# EasyEDA Pro project ProPrj_stc8h1k_ESC_2025-05-31.epro

# Schematic STC8H1K_1
Board Name: STC8H1K电调_1; Create Date: 2025-03-03; Page Name: STC8H1K; Project Name: stc8h1k电调; Schematic Name: STC8H1K_1; Update Date: 2025-05-28; Add into BOM: yes; Convert to PCB: yes
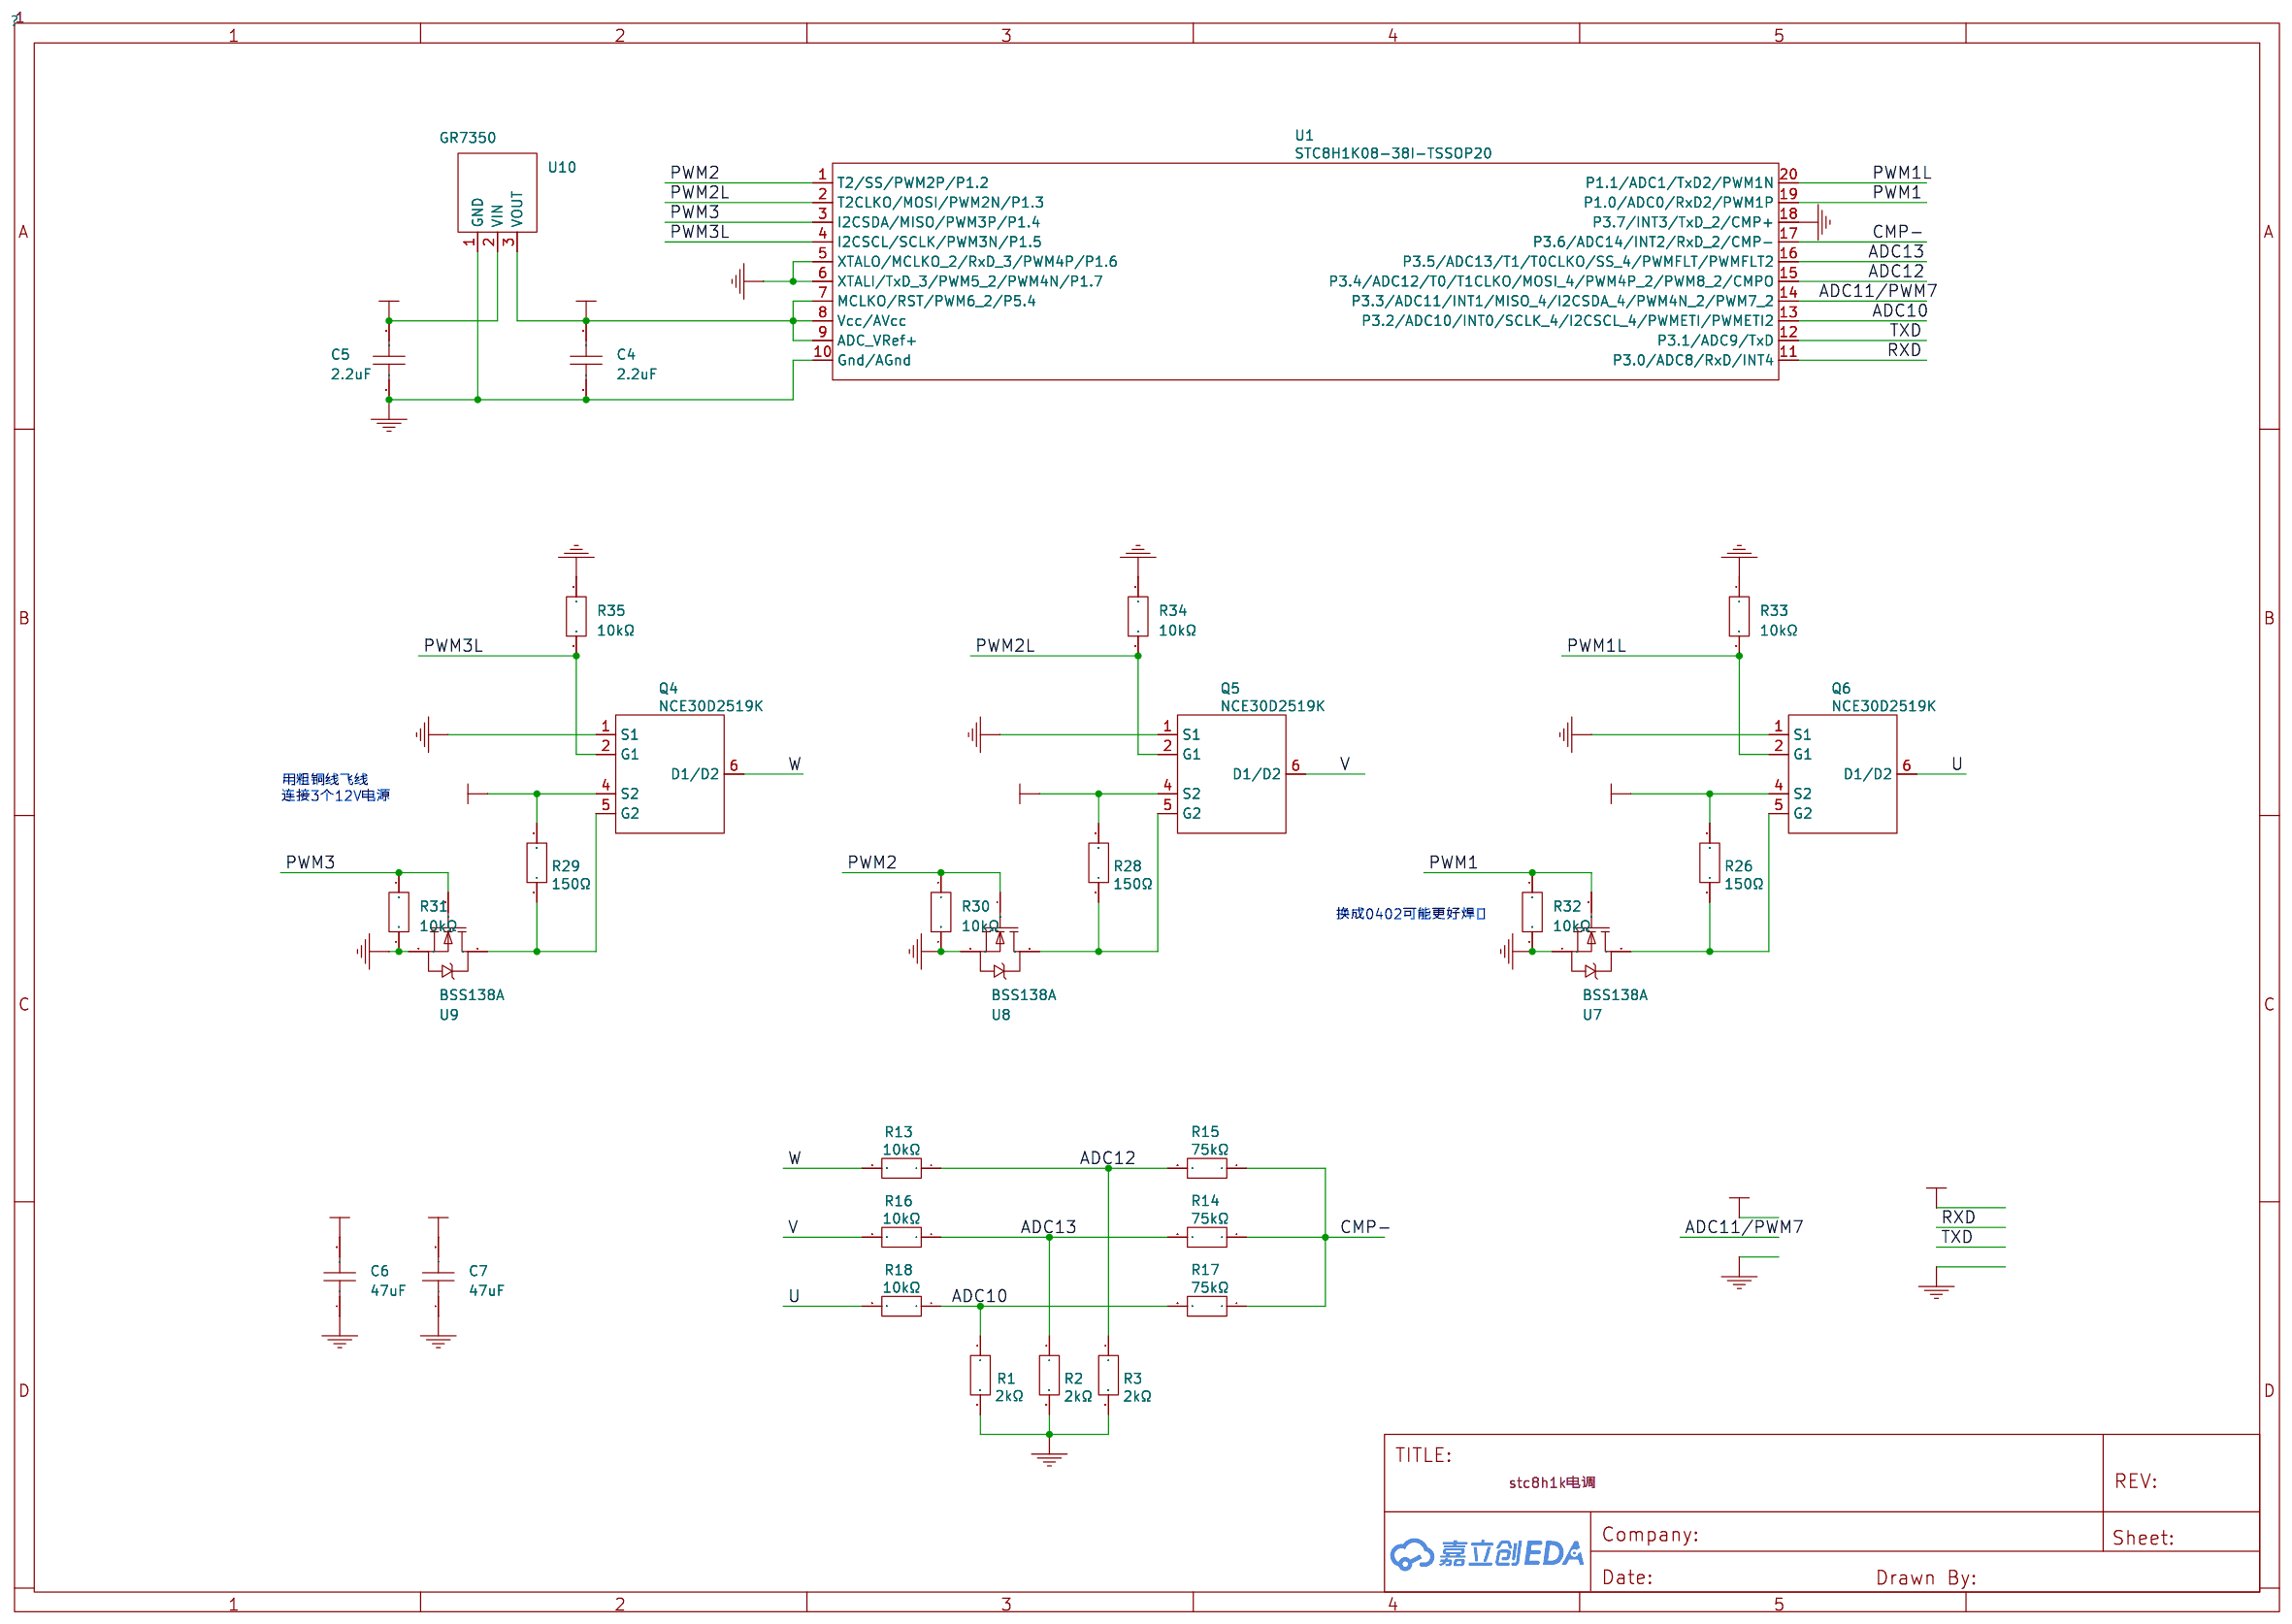
[diagram p0: schematic sheet]

## Parts
C4  2.2uF  [C0603]
C5  2.2uF  [C0603]
C6  47uF  [C1206]
C7  47uF  [C1206]
Q4  NCE30D2519K  [TO-252-5-11_L6.5-W6.2-P1.14-LS10.0-BR]
Q5  NCE30D2519K  [TO-252-5-11_L6.5-W6.2-P1.14-LS10.0-BR]
Q6  NCE30D2519K  [TO-252-5-11_L6.5-W6.2-P1.14-LS10.0-BR]
R1  2kΩ  [R0603]
R2  2kΩ  [R0603]
R3  2kΩ  [R0603]
R13  10kΩ  [R0603]
R14  75kΩ  [R0603]
R15  75kΩ  [R0603]
R16  10kΩ  [R0603]
R17  75kΩ  [R0603]
R18  10kΩ  [R0603]
R26  150Ω  [R0603]
R28  150Ω  [R0603]
R29  150Ω  [R0603]
R30  10kΩ  [R0603]
R31  10kΩ  [R0603]
R32  10kΩ  [R0603]
R33  10kΩ  [R0402]
R34  10kΩ  [R0402]
R35  10kΩ  [R0402]
U1  STC8H1K08-38I-TSSOP20  [TSSOP-20_L6.5-W4.4-P0.65-LS6.4-BL]
U7  BSS138A  [SOT-23-3_L2.9-W1.3-P0.95-LS2.4-BR]
U8  BSS138A  [SOT-23-3_L2.9-W1.3-P0.95-LS2.4-BR]
U9  BSS138A  [SOT-23-3_L2.9-W1.3-P0.95-LS2.4-BR]
U10  GR7350  [SOT-23-3_L2.9-W1.6-P1.90-LS2.8-BR-CW]

## Library data of the parts
C4 C5 = CL10A225KA8NNNC: 容值:2.2uF;精度:±10%;额定电压:25V;材质(温度系数):X5R;; LCSC Part Name: 2.2uF ±10% 25V; Supplier Part: C57895; Manufacturer: SAMSUNG(三星); Supplier Footprint: 0603; JLCPCB Part Class: Extended Part; Datasheet: https://atta.szlcsc.com/upload/public/pdf/source/20160218/1457707763339.pdf; Supplier: LCSC; Tolerance: ±10%; Voltage Rated: 25V; Temperature Coefficient: X5R
C6 C7 = GRM31CR61E476ME44L: 容值:47uF;精度:±20%;额定电压:25V;材质(温度系数):X5R;; LCSC Part Name: 47uF ±20% 25V; Supplier Part: C403725; Manufacturer: muRata(村田); Supplier Footprint: 1206; JLCPCB Part Class: 扩展库; Datasheet: https://atta.szlcsc.com/upload/public/pdf/source/20191025/C403725_B8A8CD2FFA1F57E6FDF268BD106459D5.pdf; Supplier: LCSC; Tolerance: ±20%; Voltage Rated: 25V; Temperature Coefficient: X5R
Q4-Q6 = NCE30D2519K: Supplier: LCSC; Supplier Part: C216790; Manufacturer: NCE(无锡新洁能); JLCPCB Part Class: Extended Part
R1-R3 = 0603WAF2001T5E: 电阻类型:厚膜电阻;阻值:2kΩ;精度:±1%;功率:100mW;最大工作电压:75V;温度系数:±100ppm/℃;; LCSC Part Name: 2kΩ ±1% 100mW 厚膜电阻; Supplier Part: C22975; Manufacturer: UNI-ROYAL(厚声); Supplier Footprint: 0603; JLCPCB Part Class: Basic Part; Datasheet: https://atta.szlcsc.com/upload/public/pdf/source/20200306/C422600_1E6D84923E4A46A82E41ADD87F860B5C.pdf; Supplier: LCSC; Type: 厚膜电阻; Tolerance: ±1%; Power(Watts): 100mW; Overload Voltage (Max): 75V; Temperature Coefficient: ±100ppm/℃; Operating Temperature Range: -55℃~+155℃
R13 R16 R18 R30-R35 = RT0603BRE075KL: 电阻类型:薄膜电阻;阻值:5kΩ;精度:±0.1%;功率:100mW;温度系数:±50ppm/℃;; LCSC Part Name: 薄膜电阻 5kΩ ±0.1% 100mW; Supplier Part: C862232; Manufacturer: YAGEO(国巨); Supplier Footprint: 0603; JLCPCB Part Class: Extended Part; Datasheet: https://atta.szlcsc.com/upload/public/pdf/source/20200610/C326738_5639A9F1B6EB6E4AE2197577D3456E7F.pdf; Supplier: LCSC; Type: 薄膜电阻; Tolerance: ±0.1%; Power(Watts): 100mW; Temperature Coefficient: ±50ppm/℃; Operating Temperature Range: -55℃~+155℃
R14 R15 R17 = 0603WAF1003T5E: 电阻类型:厚膜电阻;阻值:100kΩ;精度:±1%;功率:100mW;最大工作电压:75V;温度系数:±100ppm/℃;; LCSC Part Name: 100kΩ ±1% 100mW 厚膜电阻; Supplier Part: C25803; Manufacturer: UNI-ROYAL(厚声); Supplier Footprint: 0603; JLCPCB Part Class: Basic Part; Datasheet: https://atta.szlcsc.com/upload/public/pdf/source/20200306/C422600_1E6D84923E4A46A82E41ADD87F860B5C.pdf; Supplier: LCSC; Type: 厚膜电阻; Tolerance: ±1%; Power(Watts): 100mW; Overload Voltage (Max): 75V; Temperature Coefficient: ±100ppm/℃; Operating Temperature Range: -55℃~+155℃
R26 R28 R29 = 0603WAJ0151T5E: 电阻类型:厚膜电阻;阻值:150Ω;精度:±5%;功率:100mW;最大工作电压:75V;温度系数:±100ppm/℃;; LCSC Part Name: 150Ω ±5% 100mW 厚膜电阻; Supplier Part: C25208; Manufacturer: UNI-ROYAL(厚声); Supplier Footprint: 0603; JLCPCB Part Class: Extended Part; Datasheet: https://atta.szlcsc.com/upload/public/pdf/source/20200306/C422600_1E6D84923E4A46A82E41ADD87F860B5C.pdf; Supplier: LCSC; Type: 厚膜电阻; Tolerance: ±5%; Power(Watts): 100mW; Overload Voltage (Max): 75V; Temperature Coefficient: ±100ppm/℃; Operating Temperature Range: -55℃~+155℃
U1 = STC8H1K08-38I-TSSOP20: Supplier: LCSC; Supplier Part: C2928099; Manufacturer: null
U7-U9 = BSS138: 类型:N沟道;漏源电压(Vdss):50V;连续漏极电流(Id):220mA;功率(Pd):360mW;导通电阻(RDS(on)@Vgs,Id):3.5Ω@10V,220mA;阈值电压(Vgs(th)@Id):1.5V@1mA;; LCSC Part Name: N沟道 50V 220mA; Supplier Part: C52895; Manufacturer: onsemi(安森美); Supplier Footprint: SOT-23(SOT-23-3); JLCPCB Part Class: Extended Part; Datasheet: https://atta.szlcsc.com/upload/public/pdf/source/20170412/1491969107299.pdf; Supplier: LCSC; Type: N沟道; Drain Source Voltage (Vdss): 50V; Continuous Drain Current (Id): 220mA; Power Dissipation (Pd): 360mW; Drain Source On Resistance (RDS(on)@Vgs,Id): 3.5Ω@10V,220mA; Gate Threshold Voltage (Vgs(th)@Id): 1.5V@1mA
U10 = HG7550M3-1/TR: 输出类型:固定;工作电压:36V;输出电压:5V;输出电流:100mA;电源纹波抑制比(PSRR):-;输出极性:正极;; LCSC Part Name: CMOS 低压差线性稳压器; Supplier Part: C2926286; Manufacturer: HGSEMI(华冠); Supplier Footprint: SOT-23-3; JLCPCB Part Class: 扩展库; Datasheet: https://atta.szlcsc.com/upload/public/pdf/source/20221108/EF5F90A0CDAED690D23AFD681B9EC543.pdf; Supplier: LCSC; Output Type: 固定; Voltage - Supply: 36V; Output Voltage: 5V; Output Current: 100mA; Voltage Dropout: 2mV; standby current: 2uA; Operating Temperature: -40℃~+85℃; Output Configuration: 正极; Number of Outputs: 1

## Nets
5V: C4.1 U1.7(MCLKO/RST/PWM6_2/P5.4) U1.8(Vcc/AVcc) U1.9(ADC_VRef+) U10.3(VOUT)
12V: C5.2 C6.2 C7.2 Q4.4(S2) Q5.4(S2) Q6.4(S2) R26.2 R28.2 R29.2 U10.2(VIN)
GND: C4.2 C5.1 C6.1 C7.1 Q4.1(S1) Q5.1(S1) Q6.1(S1) R1.2 R2.2 R3.2 R30.2 R31.2 R32.2 R33.1 R34.1 R35.1 U1.5(XTALO/MCLKO_2/RxD_3/PWM4P/P1.6) U1.6(XTALI/TxD_3/PWM5_2/PWM4N/P1.7) U1.10(Gnd/AGnd) U1.18(P3.7/INT3/TxD_2/CMP+) U7.2(S) U8.2(S) U9.2(S) U10.1(GND)
ADC10: R1.1 R17.2 R18.1 U1.13(P3.2/ADC10/INT0/SCLK_4/I2CSCL_4/PWMETI/PWMETI2)
ADC11/PWM7: U1.14(P3.3/ADC11/INT1/MISO_4/I2CSDA_4/PWM4N_2/PWM7_2)
ADC12: R3.1 R13.1 R15.2 U1.15(P3.4/ADC12/T0/T1CLKO/MOSI_4/PWM4P_2/PWM8_2/CMPO)
ADC13: R2.1 R14.2 R16.1 U1.16(P3.5/ADC13/T1/T0CLKO/SS_4/PWMFLT/PWMFLT2)
CMP-: R14.1 R15.1 R17.1 U1.17(P3.6/ADC14/INT2/RxD_2/CMP-)
PWM1: R32.1 U1.19(P1.0/ADC0/RxD2/PWM1P) U7.1(G)
PWM1L: Q6.2(G1) R33.2 U1.20(P1.1/ADC1/TxD2/PWM1N)
PWM2: R30.1 U1.1(T2/SS/PWM2P/P1.2) U8.1(G)
PWM2L: Q5.2(G1) R34.2 U1.2(T2CLKO/MOSI/PWM2N/P1.3)
PWM3: R31.1 U1.3(I2CSDA/MISO/PWM3P/P1.4) U9.1(G)
PWM3L: Q4.2(G1) R35.2 U1.4(I2CSCL/SCLK/PWM3N/P1.5)
RXD: U1.11(P3.0/ADC8/RxD/INT4)
TXD: U1.12(P3.1/ADC9/TxD)
U: Q6.6(D1/D2) R18.2
V: Q5.6(D1/D2) R16.2
W: Q4.6(D1/D2) R13.2
$1N2495: Q5.5(G2) R28.1 U8.3(D)
$1N2516: Q6.5(G2) R26.1 U7.3(D)
$1N3815: Q4.5(G2) R29.1 U9.3(D)

## Notes on the sheet
- 用粗铜线飞线
  连接3个12V电源
- 换成0402可能更好焊➡

# Board STC8H1K_1
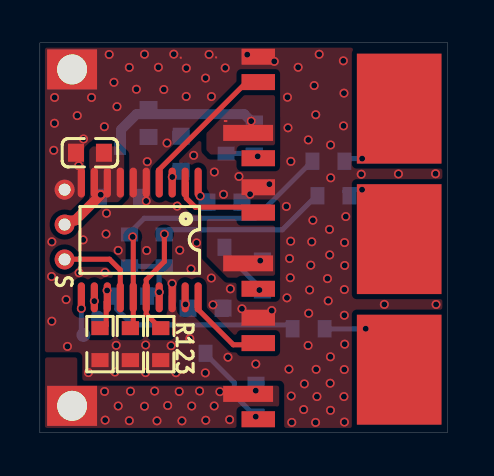
[diagram p1: board, top side]
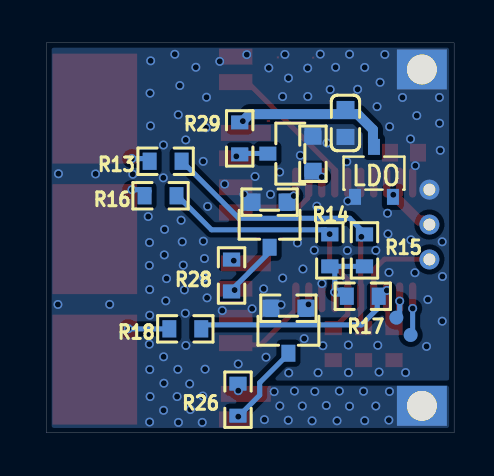
[diagram p2: board, bottom side, seen from below]

Outline 20.41 x 19.53 mm; copper layers: Top Layer, Bottom Layer. Coordinates in mm from the lower left corner of the outline.
Outline path: rectangle 0,19.53 20.41,0
Stack: Top Layer 0.035mm / Dielectric1 1.11mm FR4 er 4.5 / Bottom Layer 0.035mm

## Design rules (mm)
template: 自定义配置
spacing copperThickness1oz (default): track to track 0.15, other pairs 0.152 to 0.3
spacing copperThickness2oz: track to track 0.203, other pairs 0.152 to 0.3
track width copperThickness1oz (default): min 0.127, default 0.254, max 2.54
track width copperThickness2oz: min 0.203, default 0.254, max 2.54
differential pair differentialPair (default): width min 0.127, default 0.254, max 2.54; gap min 0.152, default 0.152
via viaSize (default): diameter min 0.45, default 0.45, max 10; hole min 0.3, default 0.3, max 6.3

## Placement (name value [footprint] x y rotation side)
C4  2.2uF  [C0603]  2.51 14.02 180 top
C5  2.2uF  [C0603]  5.44 15.51 90 bottom
C6  47uF  [C1206#2]  7.06 17.18 270 top
C7  47uF  [C1206]  8.83 17.2 270 top
NOREF  -  [Pad_e1084]  2.89 5.77 0 top
NOREF#2  -  [Pad_e271]  1.24 12.17 0 top
NOREF#3  -  [Pad_e642]  1.61 1.36 0 top
NOREF#4  -  [Pad_e269]  1.24 8.68 0 top
NOREF#5  -  [Pad_e270]  1.24 10.43 0 top
NOREF#6  -  [Pad_e640]  1.61 18.19 0 top
NOREF#7  -  [Pad_e1086]  2.18 4.9 0 top
Q4  NCE30D2519K  [TO-252-5-11_L6.5-W6.2-P1.14-LS10.0-BR]  14.21 16.28 180 top
Q5  NCE30D2519K  [TO-252-5-11_L6.5-W6.2-P1.14-LS10.0-BR]  14.21 9.75 180 top
Q6  NCE30D2519K  [TO-252-5-11_L6.5-W6.2-P1.14-LS10.0-BR]  14.21 3.22 180 top
R1  2kΩ  [R0603]  3.01 4.44 270 top
R2  2kΩ  [R0603]  6.05 4.44 270 top
R3  2kΩ  [R0603]  4.53 4.44 270 top
R13  10kΩ  [R0603]  14.45 13.59 0 bottom
R14  75kΩ  [R0603]  6.22 9.14 90 bottom
R15  75kΩ  [R0603]  4.49 9.14 90 bottom
R16  10kΩ  [R0603]  14.71 11.87 0 bottom
R17  75kΩ  [R0603]  4.57 6.84 180 bottom
R18  10kΩ  [R0603]  13.46 5.21 0 bottom
R26  150Ω  [R0603]  10.82 1.66 90 bottom
R28  150Ω  [R0603]  11.15 7.88 90 bottom
R29  150Ω  [R0603]  10.74 14.74 90 bottom
R30  10kΩ  [R0603]  9.24 11.55 0 bottom
R31  10kΩ  [R0603]  7.07 13.97 90 bottom
R32  10kΩ  [R0603]  8.3 6.24 0 bottom
R33  10kΩ  [R0402]  10.94 5.12 270 top
R34  10kΩ  [R0402]  10.94 11.65 270 top
R35  10kΩ  [R0402]  10.94 18.21 270 top
U1  STC8H1K08-38I-TSSOP20  [TSSOP-20_L6.5-W4.4-P0.65-LS6.4-BL]  5 9.66 180 top
U7  BSS138A  [SOT-23-3_L2.9-W1.3-P0.95-LS2.4-BR]  8.3 5.11 90 bottom
U8  BSS138A  [SOT-23-3_L2.9-W1.3-P0.95-LS2.4-BR]  9.24 10.42 90 bottom
U9  BSS138A  [SOT-23-3_L2.9-W1.3-P0.95-LS2.4-BR]  8.2 13.98 180 bottom
U10  GR7350  [SOT-23-3_L2.9-W1.6-P1.90-LS2.8-BR-CW]  4.01 13.06 270 bottom

## Footprints (pads in the part's own frame, mm; a bottom-side part is the same pattern mirrored in y, then rotated)
C0603
  rect 0.8x0.9 smd: 1(-0.7,0) 2(0.7,0)
C1206
  rect 0.1x0.1 smd: 1(-1.593,0) 2(1.593,0.51)
C1206#2
  rect 0.1x0.1 smd: 1(-1.593,0) 2(1.575,2.21)
Pad_e269
  round 1 hole 0.6: 1(0,0)
Pad_e270
  round 1 hole 0.6: 1(0,0)
Pad_e271
  round 1 hole 0.6: 1(0,0)
Pad_e640
  rect 2.5x2 hole 1.5: 1(0,0)
Pad_e642
  rect 2.5x2 hole 1.5: 1(0,0)
Pad_e1084
  round 0.7 smd far side: 1(0,0)
Pad_e1086
  round 0.7 smd far side: 1(0,0)
R0402
  rect 0.4x0.5 smd: 1(-0.534,0) 2(0.534,0)
R0603
  rect 0.7x0.864 smd: 1(-0.8,0) 2(0.8,0)
SOT-23-3_L2.9-W1.3-P0.95-LS2.4-BR
  rect 0.85x0.7 smd: 1(1.127,-0.95) 2(1.127,0.95) 3(-1.127,0)
SOT-23-3_L2.9-W1.6-P1.90-LS2.8-BR-CW
  rect 0.8x0.6 smd: 1(1.25,-0.95) 2(-1.25,0) 3(1.25,0.95)
TO-252-5-11_L6.5-W6.2-P1.14-LS10.0-BR
  rect 1.677x0.8 smd: 1(3.276,-2.54) 2(3.276,-1.27) 5(3.276,2.54)
  rect 2.5x0.8 smd: 4(3.784,1.27)
  rect 4.24x5.499 smd: 6(-3.784,0.057)
TSSOP-20_L6.5-W4.4-P0.65-LS6.4-BL
  oval 0.364x1.5 smd: 1(-2.925,-2.871) 2(-2.275,-2.871) 3(-1.625,-2.871) 4(-0.975,-2.871) 5(-0.325,-2.871) 6(0.325,-2.871) 7(0.975,-2.871) 8(1.625,-2.871) 9(2.275,-2.871) 10(2.925,-2.871) 11(2.925,2.871) 12(2.275,2.871) 13(1.625,2.871) 14(0.975,2.871) 15(0.325,2.871) 16(-0.325,2.871) 17(-0.975,2.871) 18(-1.625,2.871) 19(-2.275,2.871) 20(-2.925,2.871)

## Nets
5V: C4.1 NOREF#5.1 U1.7 U1.8 U1.9 U10.3
12V: C5.2 C6.2 C7.2 NOREF#3.1 Q4.4 Q5.4 Q6.4 R26.2 R28.2 R29.2 U10.2
GND: C4.2 C5.1 C6.1 C7.1 NOREF#2.1 NOREF#6.1 Q4.1 Q5.1 Q6.1 R1.2 R2.2 R3.2 R30.2 R31.2 R32.2 R33.1 R34.1 R35.1 U1.5 U1.6 U1.10 U1.18 U7.2 U8.2 U9.2 U10.1
ADC10: R1.1 R17.2 R18.1 U1.13
ADC11/PWM7: NOREF#4.1 U1.14
ADC12: R3.1 R13.1 R15.2 U1.15
ADC13: R2.1 R14.2 R16.1 U1.16
CMP-: R14.1 R15.1 R17.1 U1.17
PWM1: R32.1 U1.19 U7.1
PWM1L: Q6.2 R33.2 U1.20
PWM2: R30.1 U1.1 U8.1
PWM2L: Q5.2 R34.2 U1.2
PWM3: R31.1 U1.3 U9.1
PWM3L: Q4.2 R35.2 U1.4
RXD: NOREF#7.1 U1.11
TXD: NOREF.1 U1.12
U: Q6.6 R18.2
V: Q5.6 R16.2
W: Q4.6 R13.2
$1N2495: Q5.5 R28.1 U8.3
$1N2516: Q6.5 R26.1 U7.3
$1N3815: Q4.5 R29.1 U9.3

## Via types
v1: diameter 0.45, hole 0.3, Top Layer to Bottom Layer, 156 vias

## Routing (per net, layer and track width the routed paths; a pad name or vN(x,y) marks a point on that pad's centre or on a via; arc(x,y) is an arc through that point)
5V: length 2.6
  Top Layer w0.5: v1(3.05,11.92) 1.76,10.63 1.33,10.63 1.11,10.41
12V: length 7.6
  Bottom Layer w0.5: 4.06,14.54 4.06,14.54 4.06,15.18 4.84,15.95 10.23,15.95 v1(10.58,15.6)
  vias: v1(3.24,2.08) v1(3.27,0.64) v1(3.92,1.35) v1(4.54,2.09) v1(4.48,0.61) v1(5.24,1.34) v1(5.75,2.09) v1(5.86,0.61) v1(6.4,1.37) v1(6.98,2.08) v1(7.11,0.61) v1(7.6,1.35) v1(8,2.1) v1(8.31,0.63) v1(8.73,1.35) v1(9.01,2.07) v1(9.5,0.66) v1(10.81,2.12) v1(11.04,8.62)
GND:
  vias: v1(0.6,9.56) v1(0.58,7.83) v1(0.59,5.59) v1(0.73,16.79) v1(0.73,15.5) v1(0.69,14.14) v1(1.31,6.67) v1(1.38,4.33) v1(1.87,15.88) v1(1.94,13.37) v1(1.96,8.02) v1(2.18,14.71) v1(2.16,9.66) v1(2.43,3.02) v1(2.59,16.79) v1(3.23,15.32) v1(3.26,8.03) v1(3.34,10.99) v1(3.31,9.96) v1(3.47,18.94) v1(3.71,17.54) v1(3.76,3.05) v1(3.86,16.33) v1(3.82,4.38) v1(3.92,9.13) v1(4.48,18.29) v1(4.83,17.2) v1(5.24,18.95) v1(5.32,11.6) v1(5.35,9.13) v1(5.3,4.4) v1(5.29,3.02) v1(5.38,13.57) v1(5.94,18.3) v1(6.21,17.19) v1(6.37,14.51) v1(6.62,7.47) v1(6.57,4.36) v1(6.71,18.95) v1(6.81,3.01) v1(6.87,11.35) v1(7,9.14) v1(7.33,18.25) v1(7.33,16.84) v1(7.51,4.72) v1(7.57,8.2) v1(7.7,13.89) v1(7.85,9.51) v1(8.3,17.76) v1(8.28,3) v1(8.47,18.94) v1(8.59,16.83) v1(8.59,7.75) v1(8.74,13.05) v1(8.67,6.41) v1(9.2,11.94) v1(9.28,18.26) v1(9.42,3.79) v1(9.54,7.21) v1(9.97,12.83) v1(10.12,6.21) v1(10.38,18.93) v1(10.53,11.95) v1(10.81,3.45) v1(11.5,12.45) v1(11.61,6.12) v1(11.74,18.59) v1(12.34,11.33) v1(12.4,16.8) v1(12.43,15.27) v1(12.38,6.76) v1(12.56,9.59) v1(12.51,8.73) v1(12.54,7.77) v1(12.47,3.19) v1(12.57,13.59) v1(12.59,1.85) v1(12.62,0.53) v1(12.94,18.3) v1(13.25,2.45) v1(13.21,1.17) v1(13.44,14.66) v1(13.44,4.38) v1(13.51,7.16) v1(13.46,5.99) v1(13.62,9.56) v1(13.57,8.39) v1(13.74,17.38) v1(13.67,10.64) v1(13.82,15.92) v1(13.84,3.18) v1(13.81,0.53) v1(13.88,1.82) v1(13.99,18.95) v1(14.41,7.72) v1(14.44,6.61) v1(14.56,14.41) v1(14.5,10.18) v1(14.52,8.91) v1(14.55,3.81) v1(14.54,2.49) v1(14.55,1.13) v1(14.57,12.77) v1(15.2,18.62) v1(15.23,17) v1(15.21,15.36) v1(15.26,9.53) v1(15.25,7.17) v1(15.25,5.89) v1(15.25,3.17) v1(15.23,1.82) v1(15.25,0.55) v1(15.32,10.83) v1(15.27,8.38) v1(15.27,4.44) v1(16.1,12.94) v1(17.25,6.43) v1(17.96,12.96) v1(19.82,12.97) v1(19.85,6.43)
ADC10: length 11.6
  Top Layer w0.254: 3.16,5.22 3.32,5.37 3.32,6.55 3.41,6.64
  Bottom Layer w0.254: 12.84,5.21 12.64,5.41 4.65,5.41 3.85,6.2 3.85,6.56 3.62,6.79
  vias: v1(3.37,7.13)
ADC11/PWM7: length 4.2
  Top Layer w0.254: 4.03,6.79 4.03,8.15 3.49,8.69 1.44,8.69
ADC12: length 15.7
  Top Layer w0.254: v1(4.65,9.81) 4.68,9.78 4.68,5.21 4.69,5.2
  Bottom Layer w0.254: v1(4.65,9.81) 4.65,10.16 5.23,10.74 10.78,10.74 13.83,13.79
ADC13: length 14.1
  Top Layer w0.254: v1(6.23,9.95) 6.23,8.58 5.33,7.67 5.33,5.94 6.06,5.2 6.06,5.13
  Bottom Layer w0.254: 13.88,12.05 13.88,11.89 12.15,10.17 6.45,10.17 v1(6.23,9.95)
CMP-: length 3.5
  Bottom Layer w0.254: 5.96,8.34 R15.1 ; v1(5.98,7.04) 5.98,8.09 R14.1
  Bottom Layer w0.45: R17.1 5.58,7.04 v1(5.98,7.04)
PWM1:
  vias: v1(7.29,6.43)
PWM1L: length 4.4
  Top Layer w0.254: 7.91,6.64 7.91,6.19 9.69,4.41 11.08,4.41 11.1,4.39
PWM2:
  vias: v1(8.03,11.86)
PWM2L: length 5.5
  Top Layer w0.254: 7.28,12.53 7.33,12.47 7.33,11.74 7.78,11.3 11.5,11.3 11.63,11.16 11.63,11.05
PWM3:
  vias: v1(6.63,12.81)
PWM3L: length 7.9
  Top Layer w0.254: 11.37,17.65 10.45,17.65 5.95,13.15 5.95,12.55 5.98,12.53
RXD: length 1.4
  Bottom Layer w0.254: v1(2.07,6.23) 2.07,5.01 NOREF#7.1
TXD: length 0.9
  Bottom Layer w0.254: 2.94,5.77 2.73,5.99 v1(2.73,6.6)
U: length 2.1
  Bottom Layer w0.254: R18.2 16.31,5.21 v1(16.32,5.22)
V: length 4.5
  Top Layer w0.254: v1(16.14,12.17) 18.58,9.73 18.69,9.73
  Bottom Layer w0.254: 15.29,12.03 15.29,12.12 15.34,12.17 v1(16.14,12.17)
W: length 0.9
  Bottom Layer w0.254: 15.25,13.8 15.33,13.73 v1(16.14,13.73)
$1N2495: length 3
  Bottom Layer w0.254: 9.19,9.36 9.19,9.32 9.26,9.26 9.26,9.03 10.99,7.3 v1(10.99,7.15)
$1N2516: length 4.2
  Bottom Layer w0.254: v1(10.81,0.82) 9.74,1.89 9.74,2.51 8.32,3.93 8.28,3.93
$1N3815: length 1.9
  Bottom Layer w0.254: U9.3 9.34,13.98 11.01,13.98 10.91,13.88 v1(10.91,13.84)

## Copper pours and planes (outline as drawn; the poured copper is in the pictures)
5V on Top Layer: 2.47,11.55 2.47,14.17 2.64,14.34 3.82,14.34 4.22,13.94 4.22,11.85 3.91,11.55
12V on Top Layer: 11.78,7.77 9.4,7.77 8.36,8.81 8.36,10.69 11.78,10.69
12V on Top Layer: 0.26,3.78 1.87,3.78 1.87,1.89 0.26,1.89
12V on Top Layer: 0.09,2.36 11.99,2.36 11.99,0.1 0.09,0.1
12V on Top Layer: 8.34,15.57 8.34,14.15 8.56,13.93 11.78,13.94 11.78,17.68 10.45,17.68
12V on Bottom Layer: 0.11,2.37 9.27,2.37 10.32,1.32 10.32,0.09 0.11,0.09
GND on Top Layer: 0.08,19.45 20.3,19.45 20.3,0.07 0.08,0.07
GND on Bottom Layer: 0.04,19.48 20.37,19.48 20.37,0.05 0.04,0.05

## Text on the board
Bottom Silkscreen Layer: LDO
Top Silkscreen Layer: R123 | S
